# EAGLE design arm_motor_controller (EAGLE 7.5.0)
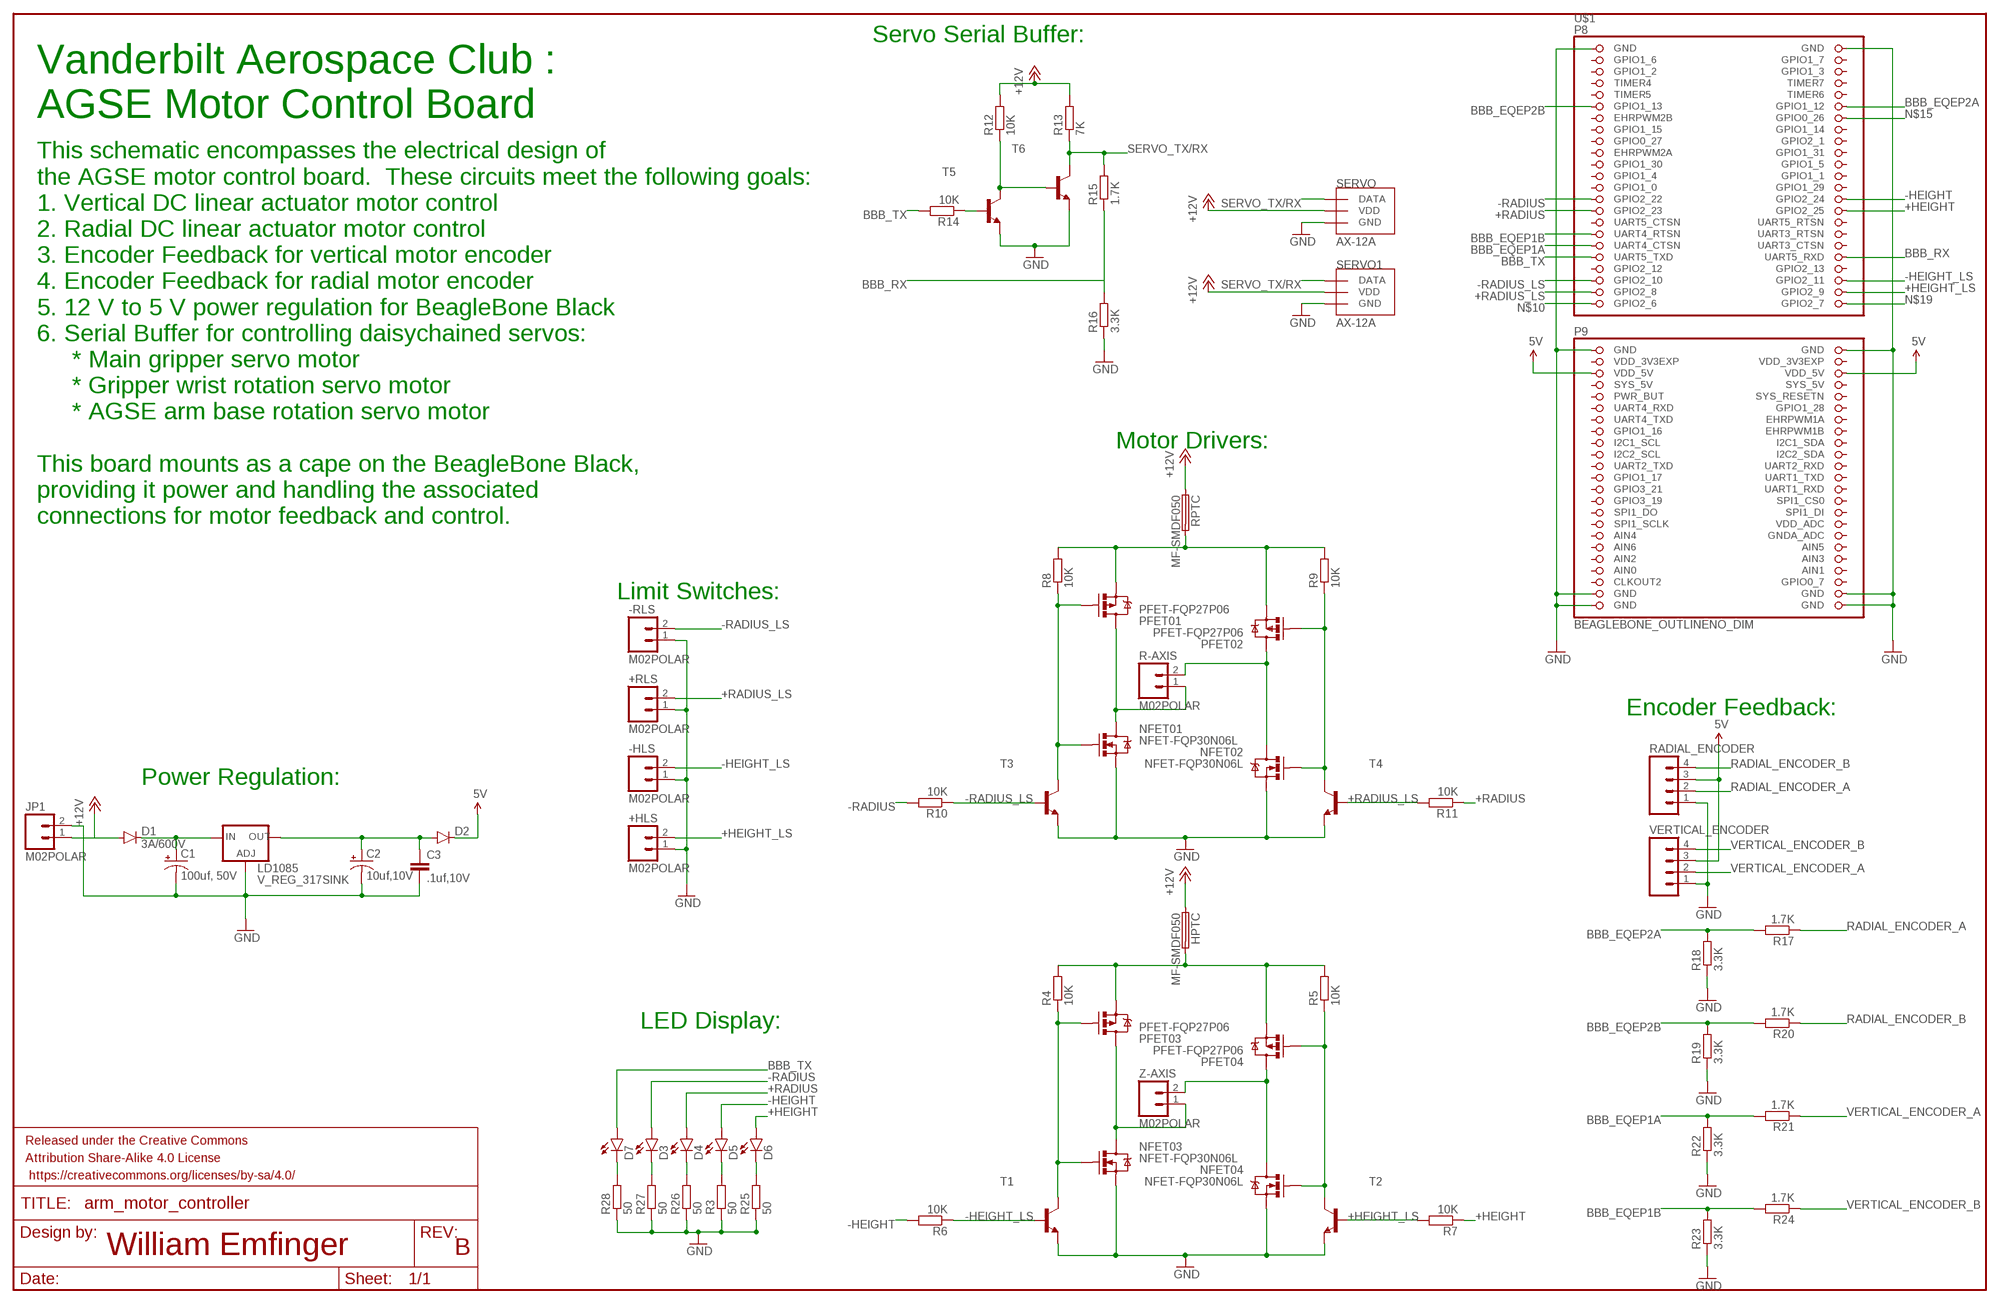
[diagram p0: schematic, sheet 1]

## Parts
+HLS  M02POLAR  [MOLEX-1X2]
+RLS  M02POLAR  [MOLEX-1X2]
-HLS  M02POLAR  [MOLEX-1X2]
-RLS  M02POLAR  [MOLEX-1X2]
C1  100uf, 50V  CAP_POLD  [PANASONIC_D]
C2  10uf,10V  CAP_POL1206  [EIA3216]
C3  .1uf,10V  CAP0402-CAP  [0402-CAP]
D1  3A/600V  DIODEES3J  [SMC]
D2  DIODE1N4148  [DIODE-1N4148]
D3  LED-FKIT-1206  [FKIT-LED-1206]
D4  LED-FKIT-1206  [FKIT-LED-1206]
D5  LED-FKIT-1206  [FKIT-LED-1206]
D6  LED-FKIT-1206  [FKIT-LED-1206]
D7  LED-FKIT-1206  [FKIT-LED-1206]
FRAME1  FRAME-LEDGER  [CREATIVE_COMMONS]
HPTC  MF-SMDF050  [MF-SMDF050]
JP1  M02POLAR  [MOLEX-1X2]
LD1085  V_REG_317SINK  [TO220-ADJ]
NFET01  NFET-FQP30N06L  MOSFET-NCHANNELFQP30N06L  [TO220V]
NFET02  NFET-FQP30N06L  MOSFET-NCHANNELFQP30N06L  [TO220V]
NFET03  NFET-FQP30N06L  MOSFET-NCHANNELFQP30N06L  [TO220V]
NFET04  NFET-FQP30N06L  MOSFET-NCHANNELFQP30N06L  [TO220V]
PFET01  PFET-FQP27P06  MOSFET-PCHANNELFQP27P06  [TO220V]
PFET02  PFET-FQP27P06  MOSFET-PCHANNELFQP27P06  [TO220V]
PFET03  PFET-FQP27P06  MOSFET-PCHANNELFQP27P06  [TO220V]
PFET04  PFET-FQP27P06  MOSFET-PCHANNELFQP27P06  [TO220V]
R3  50  R-EU_M0805  [M0805]
R4  10K  R-EU_M0805  [M0805]
R5  10K  R-EU_M0805  [M0805]
R6  10K  R-EU_M0805  [M0805]
R7  10K  R-EU_M0805  [M0805]
R8  10K  R-EU_M0805  [M0805]
R9  10K  R-EU_M0805  [M0805]
R10  10K  R-EU_M0805  [M0805]
R11  10K  R-EU_M0805  [M0805]
R12  10K  R-EU_M0805  [M0805]
R13  7K  R-EU_M0805  [M0805]
R14  10K  R-EU_M0805  [M0805]
R15  1.7K  R-EU_M0805  [M0805]
R16  3.3K  R-EU_M0805  [M0805]
R17  1.7K  R-EU_M0805  [M0805]
R18  3.3K  R-EU_M0805  [M0805]
R19  3.3K  R-EU_M0805  [M0805]
R20  1.7K  R-EU_M0805  [M0805]
R21  1.7K  R-EU_M0805  [M0805]
R22  3.3K  R-EU_M0805  [M0805]
R23  3.3K  R-EU_M0805  [M0805]
R24  1.7K  R-EU_M0805  [M0805]
R25  50  R-EU_M0805  [M0805]
R26  50  R-EU_M0805  [M0805]
R27  50  R-EU_M0805  [M0805]
R28  50  R-EU_M0805  [M0805]
R-AXIS  M02POLAR  [MOLEX-1X2]
RADIAL_ENCODER  M04POLAR  [MOLEX-1X4]
RPTC  MF-SMDF050  [MF-SMDF050]
SERVO  AX-12A  [SPOX-3]
SERVO1  AX-12A  [SPOX-3]
T1  BF820-NPN-SOT23-BEC  [SOT23-BEC]
T2  BF820-NPN-SOT23-BEC  [SOT23-BEC]
T3  BF820-NPN-SOT23-BEC  [SOT23-BEC]
T4  BF820-NPN-SOT23-BEC  [SOT23-BEC]
T5  BF820-NPN-SOT23-BEC  [SOT23-BEC]
T6  BF820-NPN-SOT23-BEC  [SOT23-BEC]
U$1  BEAGLEBONE_OUTLINENO_DIM  [BEAGLEBONE_SHIELD]
VERTICAL_ENCODER  M04POLAR  [MOLEX-1X4]
Z-AXIS  M02POLAR  [MOLEX-1X2]

## Nets
5V: D2.C RADIAL_ENCODER.3 U$1.51(VDD_5V) U$1.52(VDD_5V) VERTICAL_ENCODER.3
+12V: D1.A HPTC.1 JP1.1 R12.2 R13.2 RPTC.1 SERVO1.P$2(VDD) SERVO.P$2(VDD)
+HEIGHT: D6.A R7.1 U$1.30(GPIO2_25)
+HEIGHT_LS: +HLS.2 R7.2 T2.B U$1.44(GPIO2_9)
+RADIUS: D4.A R11.1 U$1.29(GPIO2_23)
+RADIUS_LS: +RLS.2 R11.2 T4.B U$1.43(GPIO2_8)
-HEIGHT: D5.A R6.2 U$1.28(GPIO2_24)
-HEIGHT_LS: -HLS.2 R6.1 T1.B U$1.42(GPIO2_11)
-RADIUS: D3.A R10.2 U$1.27(GPIO2_22)
-RADIUS_LS: -RLS.2 R10.1 T3.B U$1.41(GPIO2_10)
BBB_EQEP1A: R21.2 R22.2 U$1.35(UART4_CTSN)
BBB_EQEP1B: R23.2 R24.2 U$1.33(UART4_RTSN)
BBB_EQEP2A: R17.2 R18.2 U$1.12(GPIO1_12)
BBB_EQEP2B: R19.2 R20.2 U$1.11(GPIO1_13)
BBB_RX: R15.1 R16.2 U$1.38(UART5_RXD)
BBB_TX: D7.A R14.2 U$1.37(UART5_TXD)
GND: +HLS.1 +RLS.1 -HLS.1 -RLS.1 C1.- C2.C(-) C3.2 JP1.2 LD1085.ADJ NFET01.3(S) NFET02.3(S) NFET03.3(S) NFET04.3(S) R3.1 R16.1 R18.1 R19.1 R22.1 R23.1 R25.1 R26.1 R27.1 R28.1 RADIAL_ENCODER.1 SERVO1.P$3(GND) SERVO.P$3(GND) T1.E T2.E T3.E T4.E T5.E T6.E U$1.1(GND) U$1.2(GND) U$1.47(GND) U$1.48(GND) U$1.89(GND) U$1.90(GND) U$1.91(GND) U$1.92(GND) VERTICAL_ENCODER.1
H_VDD: HPTC.2 PFET03.3(S) PFET04.3(S) R4.2 R5.2
N$1: D3.C R27.2
N$2: D4.C R26.2
N$3: C1.+ D1.C LD1085.IN
N$5: D5.C R3.2
N$6: D6.C R25.2
N$7: NFET03.1(G) PFET03.1(G) R4.1 T1.C
N$8: NFET04.1(G) PFET04.1(G) R5.1 T2.C
N$9: D7.C R28.2
N$10: U$1.45(GPIO2_6)
N$13: NFET01.1(G) PFET01.1(G) R8.1 T3.C
N$14: NFET02.1(G) PFET02.1(G) R9.1 T4.C
N$15: U$1.14(GPIO0_26)
N$17: R14.1 T5.B
N$18: R12.1 T5.C T6.B
N$19: U$1.46(GPIO2_7)
R+: NFET01.2(D) PFET01.2(D) R-AXIS.1
R-: NFET02.2(D) PFET02.2(D) R-AXIS.2
R_VDD: PFET01.3(S) PFET02.3(S) R8.2 R9.2 RPTC.2
RADIAL_ENCODER_A: R17.1 RADIAL_ENCODER.2
RADIAL_ENCODER_B: R20.1 RADIAL_ENCODER.4
SERVO_TX/RX: R13.1 R15.2 SERVO1.P$1(DATA) SERVO.P$1(DATA) T6.C
VERTICAL_ENCODER_A: R21.1 VERTICAL_ENCODER.2
VERTICAL_ENCODER_B: R24.1 VERTICAL_ENCODER.4
VOUT: C2.A(+) C3.1 D2.A LD1085.OUT
Z+: NFET03.2(D) PFET03.2(D) Z-AXIS.1
Z-: NFET04.2(D) PFET04.2(D) Z-AXIS.2
Unconnected: U$1.3(GPIO1_6) U$1.4(GPIO1_7) U$1.5(GPIO1_2) U$1.6(GPIO1_3) U$1.7(TIMER4) U$1.8(TIMER7) U$1.9(TIMER5) U$1.10(TIMER6) U$1.13(EHRPWM2B) U$1.15(GPIO1_15) U$1.16(GPIO1_14) U$1.17(GPIO0_27) U$1.18(GPIO2_1) U$1.19(EHRPWM2A) U$1.20(GPIO1_31) U$1.21(GPIO1_30) U$1.22(GPIO1_5) U$1.23(GPIO1_4) U$1.24(GPIO1_1) U$1.25(GPIO1_0) U$1.26(GPIO1_29) U$1.31(UART5_CTSN) U$1.32(UART5_RTSN) U$1.34(UART3_RTSN) U$1.36(UART3_CTSN) U$1.39(GPIO2_12) U$1.40(GPIO2_13) U$1.54(SYS_5V) U$1.55(PWR_BUT) U$1.56(SYS_RESETN) U$1.57(UART4_RXD) U$1.58(GPIO1_28) U$1.59(UART4_TXD) U$1.60(EHRPWM1A) U$1.61(GPIO1_16) U$1.62(EHRPWM1B) U$1.63(I2C1_SCL) U$1.64(I2C1_SDA) U$1.65(I2C2_SCL) U$1.66(I2C2_SDA) U$1.67(UART2_TXD) U$1.68(UART2_RXD) U$1.69(GPIO1_17) U$1.70(UART1_TXD) U$1.71(GPIO3_21) U$1.72(UART1_RXD) U$1.73(GPIO3_19) U$1.74(SPI1_CS0) U$1.75(SPI1_DO) U$1.76(SPI1_DI) U$1.77(SPI1_SCLK) U$1.78(VDD_ADC) U$1.79(AIN4) U$1.80(GNDA_ADC) U$1.81(AIN6) U$1.82(AIN5) U$1.83(AIN2) U$1.84(AIN3) U$1.86(AIN1) U$1.87(CLKOUT2) U$1.88(GPIO0_7)

## Notes on the sheet
- Servo Serial Buffer:
- Vanderbilt Aerospace Club :
  AGSE Motor Control Board
- This schematic encompasses the electrical design of
  the AGSE motor control board.  These circuits meet the following goals:
  1. Vertical DC linear actuator motor control
  2. Radial DC linear actuator motor control
  3. Encoder Feedback for vertical motor encoder
  4. Encoder Feedback for radial motor encoder
  5. 12 V to 5 V power regulation for BeagleBone Black
  6. Serial Buffer for controlling daisychained servos:
       * Main gripper servo motor
       * Gripper wrist rotation servo motor
       * AGSE arm base rotation servo motor
  
  This board mounts as a cape on the BeagleBone Black, 
  providing it power and handling the associated
  connections for motor feedback and control.
- Motor Drivers:
- Limit Switches:
- Encoder Feedback:
- Power Regulation:
- LED Display:
- William Emfinger | B

## Power pins joined to a net without a drawn wire
AIN0: U$1.85(AIN0)
SYS_5V: U$1.53(SYS_5V)
VDD_3V3EXP: U$1.49(VDD_3V3EXP) U$1.50(VDD_3V3EXP)

## Library data of the parts
+HLS +RLS -HLS -RLS = SparkFun-Connectors:M02: Standard 2-pin 0.1" header. Use with - straight break away headers ( PRT-00116) - right angle break away headers (PRT-00553) - swiss pins (PRT-00743) - machine pins (PRT-00117) - female headers (PRT-00115) Molex polarized connector foot print use with: PRT-08233 with associated crimp pins and housings. 2.54_SCREWTERM for use with PRT-10571. 3.5mm Screw Terminal footprints for PRT-08084 5mm Screw Terminal footprints for use with PRT-08432
C1 = SparkFun-Passives:CAP_POL: Capacitor Polarized These are standard SMD and PTH capacitors. Normally 10uF, 47uF, and 100uF in electrolytic and tantalum varieties. Always verify the external diameter of the through hole cap, it varies with capacity, voltage, and manufacturer. The EIA devices should be standard.; MANEX: 123-0004264
C2 = SparkFun-Passives:CAP_POL: Capacitor Polarized These are standard SMD and PTH capacitors. Normally 10uF, 47uF, and 100uF in electrolytic and tantalum varieties. Always verify the external diameter of the through hole cap, it varies with capacity, voltage, and manufacturer. The EIA devices should be standard.; MANEX: 123-0001192
C3 = SparkFun-Passives:CAP: Capacitor Standard 0603 ceramic capacitor, and 0.1" leaded capacitor.; MANEX: 123-0001047
D1 = SparkFun-DiscreteSemi:DIODE: Diode These are standard reverse protection diodes and small signal diodes. SMA package can handle up to about 1A. SOD-323 can handle about 200mA. What the SOD-323 package when ordering, there are some mfgs out there that are 5-pin packages.; MANEX: 130-0001388; PROD_ID: DIO-12441
D2 = SparkFun-DiscreteSemi:DIODE: Diode These are standard reverse protection diodes and small signal diodes. SMA package can handle up to about 1A. SOD-323 can handle about 200mA. What the SOD-323 package when ordering, there are some mfgs out there that are 5-pin packages.; MANEX: 130-0002546
D3-D7 = SparkFun-LED:LED: LEDs Standard schematic elements and footprints for 5mm, 3mm, 1206, and 0603 sized LEDs. 5mm - Spark Fun Electronics SKU : COM-00529 (and others)
FRAME1 = SparkFun-Aesthetics:FRAME-LEDGER: Schematic Frame Standard 11x14 US Ledger frame
HPTC RPTC = fuse:MF-SMDF: MF-SMDF Series - PRC Resettable Fuses Source: http://www.farnell.com/datasheets/716597.pdf
JP1 R-AXIS Z-AXIS = SparkFun-Connectors:M02: Standard 2-pin 0.1" header. Use with - straight break away headers ( PRT-00116) - right angle break away headers (PRT-00553) - swiss pins (PRT-00743) - machine pins (PRT-00117) - female headers (PRT-00115) Molex polarized connector foot print use with: PRT-08233 with associated crimp pins and housings. 2.54_SCREWTERM for use with PRT-10571. 3.5mm Screw Terminal footprints for PRT-08084 5mm Screw Terminal footprints for use with PRT-08432; MANEX: 257-0004040
LD1085 = SparkFun-PowerIC:V_REG_317: Voltage Regulator Standard LM317 adjustable voltage regulator. AOI (Adjust Output Input). Google 'LM317 Calculator' for easy to use app to get the two resistor values needed. 240/720 for 5V output. 240/390 for 3.3V output. Spark Fun Electronics SKU : COM-00527
NFET01-NFET04 = SparkFun-DiscreteSemi:MOSFET-NCHANNEL: Common NMOSFET Parts MFG P/N Store ID Prod ID FDD8780 TRANS-09984 SI7820DN TRANS-11055 FDS6630A IC-08089 2N7002PW TRANS-11151 FQP30N06L COM-10213 TRANS-10060 BSS123LT1G TRANS-08345 BSS138 TRANS-00830 BS170 2N7000; PROD_ID: TRANS-10060
PFET01-PFET04 = SparkFun-DiscreteSemi:MOSFET-PCHANNEL: Generic PMOSFET IRLML2244 - TRANS-11153 (SOT-23 -20V -4.3A) (1.Gate 2.Source 3.Drain) FQP27P06 - COM-10349 <http://www.sparkfun.com/products/10349> (TO-220 -60V -27A) (1.Gate 2.Source 3.Drain)
R3-R28 = resistor:R-EU_: RESISTOR, European symbol
RADIAL_ENCODER VERTICAL_ENCODER = SparkFun-Connectors:M04: Header 4 Standard 4-pin 0.1" header. Use with straight break away headers (SKU : PRT-00116), right angle break away headers (PRT-00553), swiss pins (PRT-00743), machine pins (PRT-00117), and female headers (PRT-00115). Molex polarized connector foot print use with SKU : PRT-08231 with associated crimp pins and housings. 1MM SMD Version SKU: PRT-10208
SERVO SERVO1 = molex-spox:AX-12A: Dynamixel AX-12A female connection package. This part uses the molex spox 2.5mm 3-pin connector part number: 22-43-6030 datasheet: http://www.molex.com/pdm_docs/sd/022436030_sd.pdf
T1-T6 = transistor:*-NPN-: NPN Transistror BF959 corrected 2008.03.06
U$1 = adafruit:BEAGLEBONE_OUTLINE: Should match A3 pinout - but not completely tested

## Net classes
0 default: width 0.152 mm, drill 0.305 mm, clearance 0.152 mm

## Board
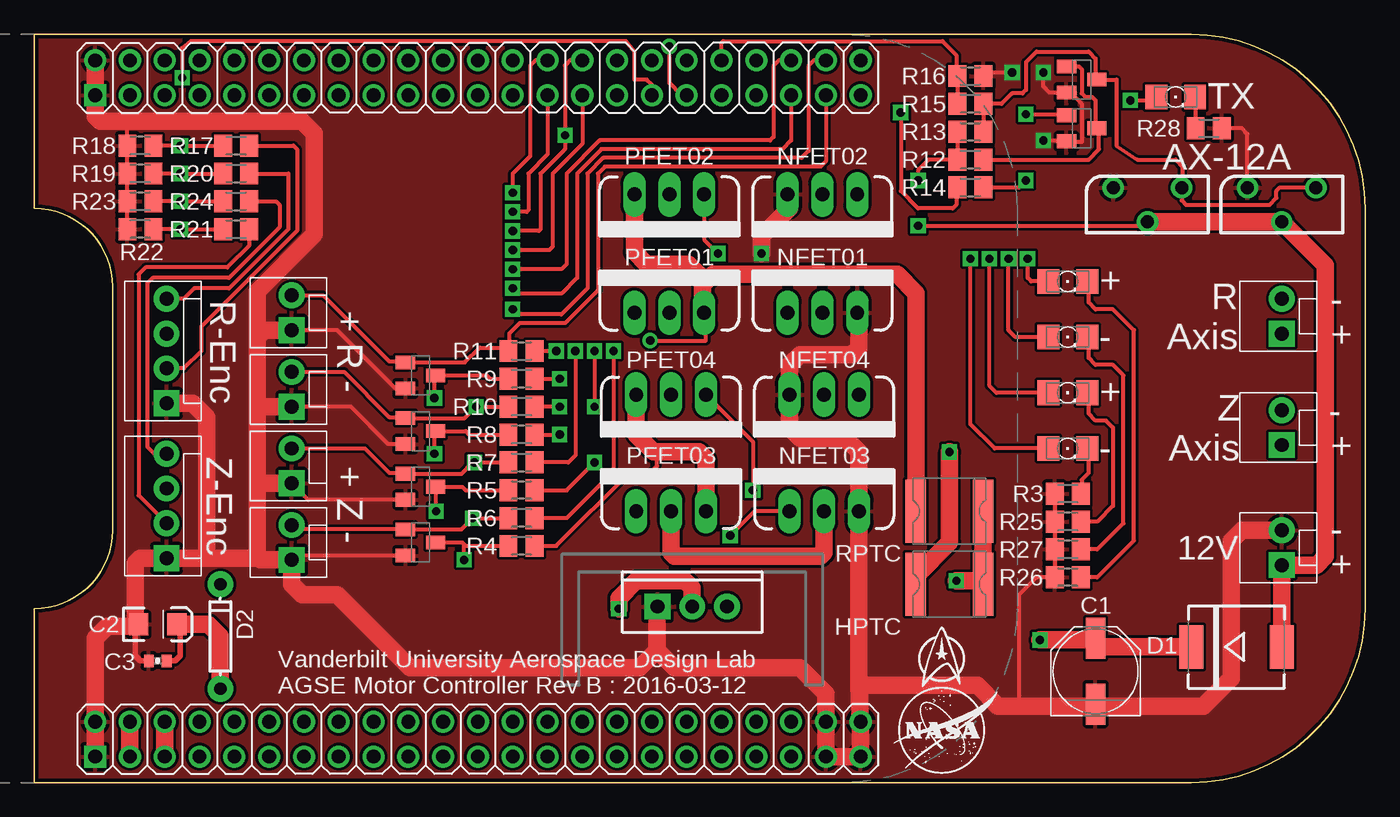
[diagram p1: board, top side]
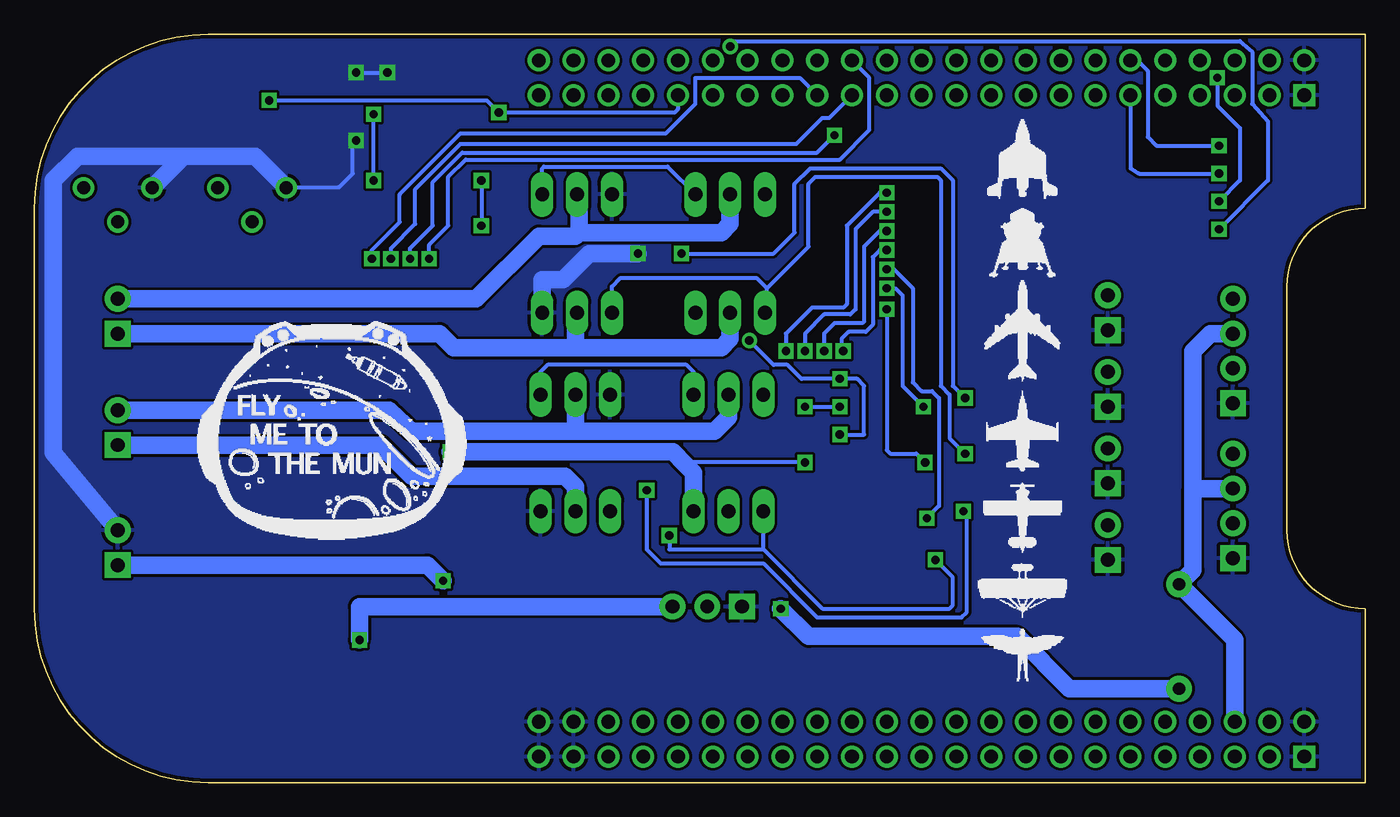
[diagram p2: board, bottom side, seen from below]

Size 97.16 x 54.61 mm. Coordinates in mm from the lower left corner, seen from the top.
Outline: 84.46,0 0,0 0,12.7 arc90 5.71,18.41 5.71,36.2 arc90 0,41.91 0,54.61 84.46,54.61 arc-90 97.16,41.91 97.16,12.7 arc-90 84.46,0
Copper layers (1*16): Top 0.035mm / dielectric 1.5mm / Bottom 0.035mm
Design rules "SparkFun": minimum track width 8mil, minimum drill 20mil, track to track 8mil, track to pad 8mil, pad to pad 8mil, via to via 8mil, smd to smd 8mil, copper to edge 10mil, drill to drill 8mil, minimum pad ring 12mil, minimum via ring 10mil, stop-mask expansion 4mil, vias tented up to drill 25mil, thermal gap 10mil

### Footprints (pad centres in the part's own frame; a part is rotated, then mirrored left to right if it is on the bottom)
MOLEX-1X2 = drill 1.016 pad 1.88 square: 1 0,0 | drill 1.016 pad 1.88: 2 2.54,0
PANASONIC_D = smd 3 x 1.4: + 2.4,0; - -2.4,0
EIA3216 = smd 1.4 x 1.6: A 1.4,0; C -1.4,0
0402-CAP = smd 0.7 x 0.9: 1 -0.65,0; 2 0.65,0
SMC = smd 1.778 x 3.175: A 3.302,0; C -3.302,0
DIODE-1N4148 = drill 0.9 pad 1.88: A -3.81,0; C 3.81,0
FKIT-LED-1206 = smd 1.6 x 1.803: A -1.422,0; C 1.422,0
MF-SMDF050 = smd 1.5 x 4.6: 1 -2.45,0; 2 2.45,0
TO220-ADJ = drill 1 pad 1.88 square: ADJ -2.54,0 | drill 1 pad 1.88: IN 2.54,0; OUT 0,0
TO220V = drill 1.016 long: 1 -2.54,0; 2 0,0; 3 2.54,0
M0805 = smd 1.3 x 1.6: 1 -0.95,0; 2 0.95,0
MOLEX-1X4 = drill 1.016 pad 1.88 square: 1 0,0 | drill 1.016 pad 1.88: 2 2.54,0; 3 5.08,0; 4 7.62,0
SPOX-3 = drill 0.95: P$1 2.5,1.25; P$2 0,-1.25; P$3 -2.5,1.25
SOT23-BEC = smd 1 x 1.4: B -0.95,-1.1; C 0,1.1; E 0.95,-1.1
BEAGLEBONE_SHIELD = drill 1 square: 1 4.445,19.05; 47 52.705,19.05 | drill 1: 2 1.905,19.05; 3 4.445,21.59; 4 1.905,21.59; 5 4.445,24.13; 6 1.905,24.13; 7 4.445,26.67; 8 1.905,26.67; 9 4.445,29.21; 10 1.905,29.21; 11 4.445,31.75; 12 1.905,31.75; 13 4.445,34.29; 14 1.905,34.29; 15 4.445,36.83; 16 1.905,36.83; 17 4.445,39.37; 18 1.905,39.37; 19 4.445,41.91; 20 1.905,41.91; 21 4.445,44.45; 22 1.905,44.45; 23 4.445,46.99; 24 1.905,46.99; 25 4.445,49.53; 26 1.905,49.53; 27 4.445,52.07; 28 1.905,52.07; 29 4.445,54.61; 30 1.905,54.61; 31 4.445,57.15; 32 1.905,57.15; 33 4.445,59.69; 34 1.905,59.69; 35 4.445,62.23; 36 1.905,62.23; 37 4.445,64.77; 38 1.905,64.77; 39 4.445,67.31; 40 1.905,67.31; 41 4.445,69.85; 42 1.905,69.85; 43 4.445,72.39; 44 1.905,72.39; 45 4.445,74.93; 46 1.905,74.93; 48 50.165,19.05; 49 52.705,21.59; 50 50.165,21.59; 51 52.705,24.13; 52 50.165,24.13; 53 52.705,26.67; 54 50.165,26.67; 55 52.705,29.21; 56 50.165,29.21; 57 52.705,31.75; 58 50.165,31.75; 59 52.705,34.29; 60 50.165,34.29; 61 52.705,36.83; 62 50.165,36.83; 63 52.705,39.37; 64 50.165,39.37; 65 52.705,41.91; 66 50.165,41.91; 67 52.705,44.45; 68 50.165,44.45; 69 52.705,46.99; 70 50.165,46.99; 71 52.705,49.53; 72 50.165,49.53; 73 52.705,52.07; 74 50.165,52.07; 75 52.705,54.61; 76 50.165,54.61; 77 52.705,57.15; 78 50.165,57.15; 79 52.705,59.69; 80 50.165,59.69; 81 52.705,62.23; 82 50.165,62.23; 83 52.705,64.77; 84 50.165,64.77; 85 52.705,67.31; 86 50.165,67.31; 87 52.705,69.85; 88 50.165,69.85; 89 52.705,72.39; 90 50.165,72.39; 91 52.705,74.93; 92 50.165,74.93

### Placement (x,y rotation side)
+HLS  18.8,21.84 90 top
+RLS  18.8,33.02 90 top
-HLS  18.8,16.26 90 top
-RLS  18.8,27.43 90 top
C1  77.47,8.13 90 top
C2  9.02,11.56 0 top
C3  9.02,8.89 180 top
D1  87.76,9.91 0 top
D2  13.59,10.67 90 top
D3  75.44,32.51 0 top
D4  75.44,36.58 0 top
D5  75.44,24.38 0 top
D6  75.44,28.45 0 top
D7  83.31,50.04 0 top
DRILEGEND  [DRILEGEND]  -4.06,-0.25 0 top  (outside the outline)
FRAME1  -4.06,-0.25 90 top  (outside the outline)
HPTC  66.8,14.48 180 top
JP1  91.06,15.88 90 top
LD1085  48.03,12.85 0 top
NFET01  57.53,34.29 0 top
NFET02  57.53,42.93 180 top
NFET03  57.66,19.81 0 top
NFET04  57.66,28.32 180 top
PFET01  46.35,34.29 0 top
PFET02  46.35,42.93 180 top
PFET03  46.48,19.81 0 top
PFET04  46.48,28.32 180 top
R3  75.44,21.08 0 top
R4  35.56,17.27 0 top
R5  35.56,21.34 0 top
R6  35.56,19.3 0 top
R7  35.56,23.37 180 top
R8  35.56,25.4 0 top
R9  35.56,29.46 0 top
R10  35.56,27.43 0 top
R11  35.56,31.5 180 top
R12  68.33,45.47 180 top
R13  68.33,47.5 180 top
R14  68.33,43.43 180 top
R15  68.33,49.53 0 top
R16  68.33,51.56 180 top
R17  14.73,46.48 180 top
R18  7.75,46.48 0 top
R19  7.75,44.45 0 top
R20  14.73,44.45 180 top
R21  14.73,40.39 180 top
R22  7.75,40.39 0 top
R23  7.75,42.42 0 top
R24  14.73,42.42 180 top
R25  75.44,19.05 0 top
R26  75.44,14.99 0 top
R27  75.44,17.02 0 top
R28  85.72,47.75 180 top
R-AXIS  91.06,32.77 90 top
RADIAL_ENCODER  9.65,27.69 90 top
RPTC  66.8,19.81 180 top
SERVO  91.06,42.16 0 top
SERVO1  81.25,42.16 0 top
T1  28.19,17.53 270 top
T2  28.19,21.59 270 top
T3  28.19,25.65 270 top
T4  28.19,29.72 270 top
T5  76.45,47.75 270 top
T6  76.45,51.31 270 top
U$1  -14.61,54.61 270 top
VERTICAL_ENCODER  9.65,16.38 90 top
Z-AXIS  91.06,24.64 90 top

### Tracks (layer width: path | path; a pad name or v marks a point on that pad's centre or on a via)
5V
  Top 1.27: U$1.51 U$1.52
  Bottom 1.27: RADIAL_ENCODER.3 11.3,32.77 12.57,31.5 12.57,21.46 | 12.57,21.46 VERTICAL_ENCODER.3 | 12.57,21.46 12.57,15.49 D2.C 9.53,10.41 U$1.52
+12V  (via drill 0.6)
  Top 0.305: R13.2 R12.2 65.28,45.47 64.52,44.7 v64.52,43.94 | v64.52,40.64 80.98,40.64 SERVO1.P$2
  Top 1.27: D1.A JP1.1 93.6,15.88 94.23,16.51 94.23,37.74 SERVO.P$2 SERVO1.P$2 | v67.31,14.73 69.25,14.73 | RPTC.1 69.25,14.73 | 69.25,14.73 HPTC.1
  Bottom 0.305: v64.52,43.94 v64.52,40.64
  Bottom 1.27: JP1.1 68.45,15.88 v67.31,14.73
+HEIGHT  (via drill 0.6)
  Top 0.305: U$1.30 39.12,52.71 38.73,52.32 38.73,47.75 v38.73,47.24 38.73,46.23 36.96,44.45 36.96,40.39 36.83,40.26 v34.92,40.26 | v39.5,31.5 39.5,23.88 38.99,23.37 R7.1 | D6.A 70.23,28.45 69.72,28.96 v69.72,38.23
  Bottom 0.305: v34.92,40.26 35.43,40.26 36.58,39.12 36.58,33.66 36.7,33.53 38.73,33.53 39.5,32.77 v39.5,31.5 | v69.72,38.23 69.72,38.99 68.07,40.64 68.07,43.82 65.91,45.97 40.01,45.97 v38.73,47.24
+HEIGHT_LS  (via drill 0.6)
  Top 0.305: R7.2 v32.13,23.37 32,23.37 31.18,22.54 T2.B 27.03,22.61 25.91,22.61 24.13,24.38 +HLS.2 | U$1.44 56.9,52.71 56.52,52.32 56.52,46.1 56.01,45.59 41.53,45.59 40.39,44.45 40.39,36.07 38.48,34.16 35.31,34.16 v34.92,34.54
  Bottom 0.305: v34.92,34.54 34.92,24.26 34.67,24 32.77,24 v32.13,23.37
+RADIUS  (via drill 0.6)
  Top 0.305: U$1.29 40.01,46.61 37.85,44.45 37.85,39.12 37.59,38.86 v34.92,38.86 | v38.1,31.5 R11.1 | D4.A 72.77,36.58 72.52,36.83 v72.52,38.23
  Bottom 0.305: v34.92,38.86 35.43,38.86 35.94,38.35 35.94,33.4 36.45,32.89 37.72,32.89 38.23,32.39 38.23,31.62 v38.1,31.5 | v72.52,38.23 72.52,38.86 70.49,40.89 70.49,42.93 66.04,47.37 51.05,47.37 48.9,49.53 48.9,51.44 41.27,51.44 U$1.29
+RADIUS_LS
  Top 0.305: +RLS.2 21.08,35.56 25.91,30.73 27.03,30.73 T4.B 31.43,30.67 32.51,31.75 34.36,31.75 R11.2 34.67,31.56 34.67,32.77 35.43,33.53 38.73,33.53 41.15,35.94 41.15,44.45 41.66,44.96 57.4,44.96 57.78,45.34 U$1.43
-HEIGHT  (via drill 0.6)
  Top 0.305: U$1.28 36.58,52.71 36.2,52.32 36.2,45.72 34.92,44.45 v34.92,43.05 | v42.29,31.5 42.29,22.73 38.86,19.3 R6.2 | D5.A 70.1,24.38 68.33,26.16 v68.33,38.23
  Bottom 0.305: v34.92,43.05 35.43,43.05 37.85,40.64 37.85,34.93 38.1,34.67 40.39,34.67 42.29,32.77 v42.29,31.5 | v68.33,38.23 68.33,39.24 66.93,40.64 66.93,44.2 65.66,45.47 38.35,45.47 36.2,47.62 36.2,51.44 U$1.28
-HEIGHT_LS  (via drill 0.6)
  Top 0.305: R6.1 32.26,19.3 v32,19.3 31.18,18.48 T1.B 19.12,18.48 -HLS.2 | U$1.42 54.36,52.71 53.98,52.32 53.98,47.12 53.72,46.86 41.27,46.86 38.86,44.45 38.86,37.85 38.48,37.47 v34.92,37.47
  Bottom 0.305: v34.92,37.47 34.42,37.47 33.02,36.07 33.02,29.21 32.38,28.57 31.62,28.57 31.12,28.07 31.12,20.19 v32,19.3
-RADIUS  (via drill 0.6)
  Top 0.305: U$1.27 37.47,45.85 36.07,44.45 36.07,41.78 35.94,41.66 v34.92,41.66 | v40.89,31.5 v40.89,27.43 | v38.35,27.43 R10.2 | D3.A 71.63,32.51 71.12,33.02 v71.12,38.23
  Bottom 0.305: v34.92,41.66 35.94,41.66 37.21,40.39 37.21,34.54 37.59,34.16 39.5,34.16 40.89,32.77 v40.89,31.5 | v40.89,27.43 v38.35,27.43 | v71.12,38.23 71.12,38.99 69.34,40.77 69.34,43.31 66.04,46.61 41.53,46.61 39.62,48.51 39.12,48.51 U$1.27
-RADIUS_LS  (via drill 0.6)
  Top 0.305: R10.1 v32.26,27.43 31.88,27.05 31.43,26.6 T3.B 27.03,26.67 25.91,26.67 22.61,29.97 -RLS.2 | U$1.41 55.24,46.86 54.61,46.23 41.4,46.23 39.62,44.45 39.62,36.83 38.48,35.69 35.31,35.69 v34.92,36.07
  Bottom 0.305: v34.92,36.07 34.29,36.07 33.78,35.56 33.78,28.96 v32.26,27.43
BBB_EQEP1A  (via drill 0.6)
  Top 0.305: U$1.35 47.24,50.16 46.35,51.05 v46.35,53.72 | R21.2 v10.67,40.39 R22.2
  Bottom 0.305: v46.35,53.72 46.35,53.98 46.23,54.1 9.14,54.1 8.26,53.34 8.26,49.53 7.11,48.26 7.11,43.94 v10.67,40.39
BBB_EQEP1B  (via drill 0.6)
  Top 0.305: U$1.33 45.09,50.93 44.7,51.31 43.81,51.31 43.81,53.34 43.18,54.1 11.43,54.1 10.79,53.59 v10.79,51.44 | R24.2 v10.67,42.42 R23.2
  Bottom 0.305: v10.79,51.44 10.79,49.4 9.14,47.75 9.14,43.94 v10.67,42.42
BBB_EQEP2A  (via drill 0.6)
  Top 0.305: R17.2 v10.67,46.48 R18.2
  Bottom 0.305: U$1.12 16.64,52.71 15.88,51.94 15.88,47.12 15.24,46.48 v10.67,46.48
BBB_EQEP2B  (via drill 0.6)
  Top 0.305: R20.2 v10.67,44.45 R19.2
  Bottom 0.305: U$1.11 17.14,44.83 16.51,44.45 v10.67,44.45
BBB_RX
  Top 0.305: U$1.38 50.16,53.98 50.29,54.1 66.29,54.1 67.31,53.09 67.31,51.63 R16.2 R15.1
BBB_TX  (via drill 0.6)
  Top 0.305: 81.89,50.14 D7.A 81.64,49.78 v80.01,49.78 | v63.25,48.9 63.25,43.18 64.52,41.91 67.06,41.91 67.31,42.16 67.31,43.18 67.38,43.25 R14.2
  Bottom 0.305: v80.01,49.78 64.13,49.78 v63.25,48.9 50.42,48.9 50.16,49.15 U$1.37
GND  (via drill 0.6)
  Top 0.305: 60.39,16.83 60.2,17.02 | v73.66,51.82 73.66,50.8 74.1,50.36 T6.E 75.67,50.04 75.95,50.04 76.45,49.53 76.45,46.74 75.42,46.74 T5.E 75.29,46.86 v73.66,46.86 | v71.37,51.82 69.53,51.82 R16.1 | T1.E 19.12,16.58 -HLS.1 | T2.E 20,20.64 +HLS.1 | T3.E 25.84,24.7 23.11,27.43 -RLS.1 | T4.E 26.35,28.77 22.1,33.02 +RLS.1 | 6.1,48.13 6.22,48.26 | 8.13,48.13 8.26,48.26 | 10.16,48.13 10.29,48.26 | R22.1 R23.1 R19.1 R18.1 6.8,48.07 6.98,48.26 | R3.1 R25.1 R27.1 R26.1 73.15,14.99 71.88,13.72 71.88,5.84 71.63,5.59 | SERVO.P$3 88.56,47.33 88.14,47.75 R28.1
  Top 0.406: C2.C 7.37,11.31 7.37,9.27 7.75,8.89 C3.2
  Top 1.27: NFET01.3 60.2,34.16 60.2,31.75 59.69,31.24 55.88,31.24 55.12,30.48 NFET04.3 55.12,25.91 55.88,25.15 59.18,25.15 60.2,24.13 NFET03.3 60.2,17.02 60.2,7.11 | 60.2,7.11 U$1.92 U$1.91 U$1.89 U$1.90 57.78,6.48 55.88,8.38 46.74,8.38 45.47,9.65 | 60.2,7.11 68.83,7.11 70.36,5.59 71.63,5.59 77.33,5.59 C1.- 77.61,5.59 85.34,5.59 87.38,7.62 87.38,17.65 88.14,18.41 JP1.2 | U$1.47 U$1.48 4.45,10.54 5.33,11.43 7.49,11.43 C2.C 7.37,11.81 7.37,16 7.75,16.38 VERTICAL_ENCODER.1 12.57,16.38 | LD1085.ADJ 45.47,12.83 45.47,9.65 | U$1.2 U$1.1 4.45,48.64 4.83,48.26 6.22,48.26 6.98,48.26 8.26,48.26 10.29,48.26 19.56,48.26 20.45,47.37 20.45,40.01 16.26,35.81 16.26,32.51 | 16.26,16.38 16.51,16.26 -HLS.1 18.8,14.48 19.56,13.72 22.1,13.72 27.43,8.38 44.2,8.38 45.47,9.65 | +RLS.1 16.76,33.02 16.26,32.51 | 16.26,32.51 16.26,27.43 | 16.26,27.43 16.26,21.84 | 16.26,21.84 16.26,16.38 | 16.26,27.43 -RLS.1 | 16.26,21.84 +HLS.1 | v53.09,38.61 53.09,39.88 55.12,41.91 55.12,42.8 NFET02.3 | 12.57,16.38 12.57,26.67 11.56,27.69 RADIAL_ENCODER.1 | 16.26,16.38 12.57,16.38
  Bottom 0.305: v73.66,51.82 v71.37,51.82 | 78.75,43.45 74.91,43.45 73.91,44.45 73.91,46.61 v73.66,46.86
  Bottom 1.27: SERVO1.P$3 78.75,43.45 81.03,45.72 86.25,45.72 | 86.25,45.72 SERVO.P$3 | 86.25,45.72 93.98,45.72 95.76,43.94 95.76,24.07 JP1.2 | NFET01.3 60.07,36.7 58.55,36.7 56.64,38.61 v53.09,38.61
  pour Bottom: -0.25,55.63 -0.25,-0.25 97.54,-0.25 97.54,55.63
  pour Top: -0.25,55.63 -0.25,-0.25 97.54,-0.25 97.54,55.63
H_VDD  (via drill 0.6)
  Top 0.305: 36.45,17.27 R4.2 38.1,17.27 43.43,22.61 44.96,22.61 45.47,23.11 45.47,24.13 | R5.2 38.86,21.34 v40.89,23.37
  Top 1.27: HPTC.2 64.35,15.08 66.8,17.53 v66.8,24.13 | PFET04.3 43.94,25.4 45.21,24.13 45.47,24.13 48.51,24.13 49.02,23.62 PFET03.3
  Bottom 0.305: v40.89,23.37 49.53,23.37 49.66,23.24
  Bottom 1.27: PFET03.3 49.02,22.61 49.66,23.24 50.55,24.13 v66.8,24.13
N$1
  Top 0.305: D3.C 76.96,32.41 76.96,30.99 77.47,30.48 78.74,30.48 79.5,29.72 79.5,18.92 77.6,17.02 R27.2
N$2
  Top 0.305: D4.C 76.96,36.47 76.96,35.05 77.47,34.54 78.74,34.54 80.26,33.02 80.26,17.65 77.6,14.99 R26.2
N$3  (via drill 0.6)
  Top 1.27: v73.41,10.41 77.36,10.41 C1.+ 77.47,9.91 D1.C
  Bottom 1.27: LD1085.IN 73.41,12.85 v73.41,10.41
N$5
  Top 0.305: D5.C 76.96,24.28 76.96,22.61 76.45,22.1 76.45,21.15 R3.2
N$6
  Top 0.305: D6.C 76.96,28.35 76.96,26.92 77.47,26.42 78.23,26.42 78.74,25.91 78.74,20.19 77.6,19.05 R25.2
N$7  (via drill 0.6)
  Top 0.305: NFET03.1 52.58,19.81 v50.8,18.03 | T1.C 31.24,17.53 31.37,17.4 | 31.37,17.4 31.5,17.27 R4.1 | v31.37,16.26 31.37,17.4
  Bottom 0.305: v50.8,18.03 50.8,17.02 43.94,17.02 | 43.94,17.02 PFET03.1 | 43.94,17.02 39.62,12.7 30.35,12.7 30.1,12.95 30.1,14.99 v31.37,16.26
N$8  (via drill 0.6)
  Top 0.305: R5.1 31.5,21.34 31.24,21.59 T2.C 29.34,21.55 v29.34,19.81 | PFET04.1 52.45,24.89 v52.45,21.34
  Bottom 0.305: PFET04.1 49.02,29.97 49.53,30.48 59.69,30.48 60.2,29.97 NFET04.1 | v52.45,21.34 52.45,17.02 51.44,16 43.94,16 40.01,12.07 29.46,12.07 29.08,12.45 29.08,19.56 v29.34,19.81
N$9
  Top 0.305: R28.2 84.78,50 D7.C
N$13  (via drill 0.6)
  Top 0.305: R8.1 31.75,25.4 31.5,25.65 T3.C 29.21,25.57 v29.21,24
  Bottom 0.305: NFET01.1 54.99,36.2 54.36,36.83 44.45,36.83 43.69,36.07 | PFET01.1 43.69,34.42 43.69,36.07 | 43.69,36.07 40.64,39.12 40.64,43.69 40.13,44.2 31.24,44.2 30.99,43.94 30.99,28.96 30.35,28.32 30.35,25.15 v29.21,24
N$14  (via drill 0.6)
  Top 0.305: R9.1 33.27,29.46 33.02,29.72 T4.C 29.21,29.63 v29.21,28.07 | PFET02.1 48.9,39.62 v49.91,38.61
  Bottom 0.305: NFET02.1 60.07,44.83 59.94,44.96 50.93,44.96 PFET02.1 49.02,43.05 | v49.91,38.61 43.18,38.61 41.66,40.13 41.66,43.69 40.51,44.83 30.99,44.83 30.1,43.94 30.1,28.96 v29.21,28.07
N$17  (via drill 0.6)
  Top 0.305: R14.1 71.88,43.43 v72.39,43.94 | v72.39,48.77 75.29,48.77 T5.B
  Bottom 0.305: v72.39,43.94 v72.39,48.77
N$18
  Top 0.305: R12.1 76.96,45.47 77.72,46.23 77.72,47.58 T5.C 77.47,47.84 77.47,49.78 77.22,50.04 76.71,50.04 76.45,50.29 76.45,52.07 76.27,52.26 T6.B
R+
  Bottom 1.27: R-AXIS.1 67.56,32.77 66.55,31.75 57.66,31.75 | 57.66,31.75 57.66,34.16 NFET01.2 | PFET01.2 46.35,32.39 46.99,31.75 57.66,31.75
R-
  Bottom 1.27: R-AXIS.2 64.9,35.31 60.32,39.88 57.66,39.88 57.4,40.13 | 57.4,40.13 57.4,42.8 NFET02.2 | PFET02.2 46.35,40.77 46.99,40.13 57.4,40.13
R_VDD  (via drill 0.6)
  Top 0.305: R9.2 v38.35,29.46 | v44.96,32.26 49.02,32.26 49.02,34.16 PFET01.3 | R8.2 v38.35,25.4
  Top 1.27: PFET02.3 43.81,38.73 44.7,37.85 47.75,37.85 49.02,36.58 | RPTC.2 64.35,35.72 62.99,37.08 49.53,37.08 49.02,36.58 | 49.02,36.58 48.77,36.32 48.77,34.42 PFET01.3
  Bottom 0.305: v44.96,32.26 43.18,30.48 42.16,30.48 41.15,29.46 v38.35,29.46 37.08,29.46 36.58,28.96 36.58,25.4 v38.35,25.4
RADIAL_ENCODER_A
  Top 0.305: RADIAL_ENCODER.2 10.92,30.23 12.19,31.5 12.19,33.27 19.18,40.26 19.18,46.23 18.92,46.48 R17.1
RADIAL_ENCODER_B
  Top 0.305: RADIAL_ENCODER.4 10.92,35.31 11.68,36.07 14.22,36.07 18.54,40.39 18.54,44.45 R20.1
SERVO_TX/RX
  Top 0.305: R13.1 R15.2 70.61,49.53 71.37,50.29 72.14,50.29 72.39,50.55 72.39,52.58 73.15,53.34 76.96,53.34 77.47,52.83 77.47,51.39 T6.C 78.99,51.31 78.99,46.48 80.52,45.47 83.31,45.47 83.82,44.96 83.82,43.48 SERVO1.P$1 83.75,42.48 84.07,42.16 90.17,42.16 90.68,42.67 90.68,43.18 90.93,43.43 93.54,43.43 SERVO.P$1
VDD_3V3EXP
  Top 1.27: U$1.49 U$1.50
VERTICAL_ENCODER_A
  Top 0.305: VERTICAL_ENCODER.2 7.62,20.95 7.62,37.08 8.13,37.59 14.1,37.59 15.68,39.18 R21.1
VERTICAL_ENCODER_B
  Top 0.305: VERTICAL_ENCODER.4 8.76,24 8.26,24.51 8.26,36.45 8.64,36.83 14.22,36.83 17.91,40.51 17.91,42.16 17.65,42.42 R24.1
VOUT  (via drill 0.6)
  Top 0.406: C2.A 10.67,11.31 10.67,9.27 10.29,8.89 C3.1
  Top 1.27: C2.A 12.7,11.56 13.59,10.67 D2.A | v42.67,12.7 42.67,13.46 43.94,14.73 47.5,14.73 48.01,14.22 48.01,12.88 LD1085.OUT
  Bottom 1.27: v42.67,12.7 40.64,10.67 25.4,10.67 21.59,6.86 D2.A
Z+
  Top 1.27: PFET03.2 46.48,16.76 46.74,16.51 57.4,16.51 57.66,16.76 NFET03.2
  Bottom 1.27: Z-AXIS.1 71.88,24.64 69.6,22.35 58.42,22.35 57.66,21.59 NFET03.2
Z-
  Bottom 1.27: Z-AXIS.2 71.25,27.18 69.6,25.65 57.66,25.65 | 57.66,25.65 NFET04.2 | PFET04.2 46.48,26.67 47.5,25.65 57.66,25.65

### Text on the board
tPlace: TX | AX-12A | + | - | R / Axis | R-Enc | + R - | - | + | + | Z / Axis | - | - | + | + Z - | Z-Enc | - | 12V | + | Vanderbilt University Aerospace Design Lab | AGSE Motor Controller Rev B : 2016-03-12